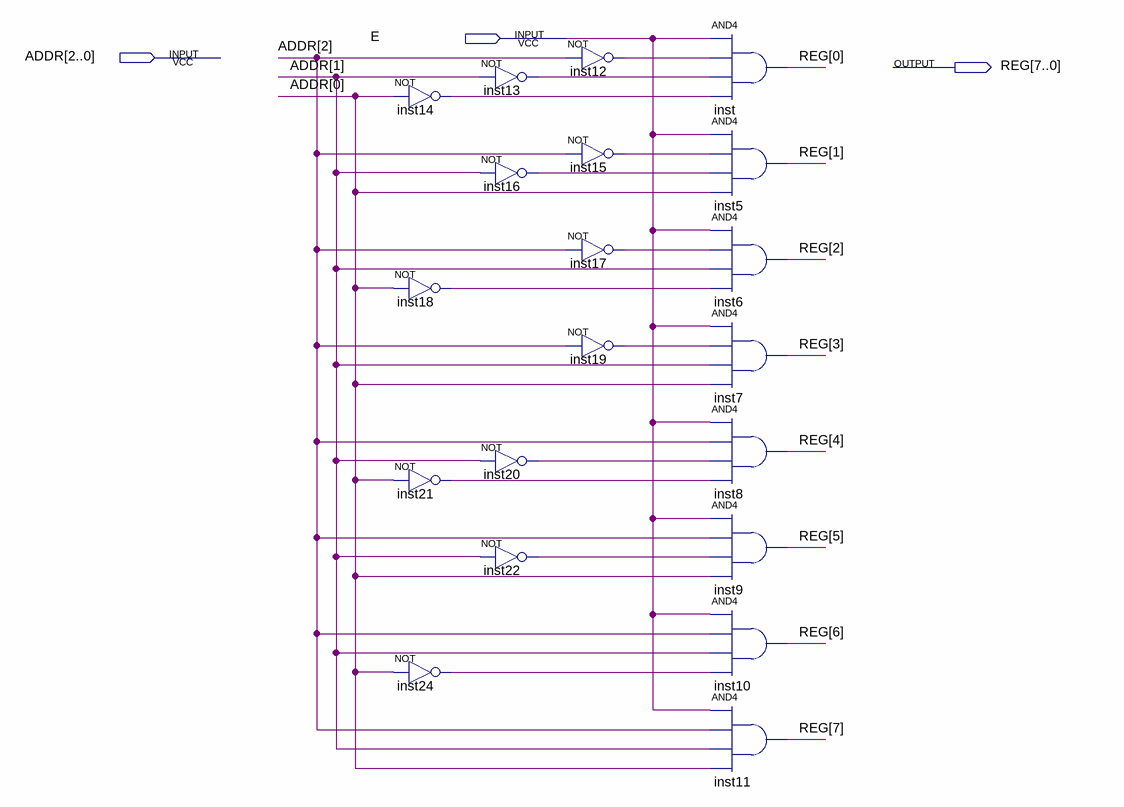
[diagram p0: schematic sheet]
// Quartus schematic Decoder3to8.bdf as structural Verilog: 20 symbols, 3 pins
module Decoder3to8 (
  input  E,
  input  [2:0] ADDR,
  output [7:0] REG
);

  wire inst12_out, inst13_out, inst14_out, inst15_out, inst16_out, inst17_out, inst18_out, inst19_out,
       inst20_out, inst21_out, inst22_out, inst24_out;

  not inst14 (inst14_out, ADDR[0]);
  not inst18 (inst18_out, ADDR[0]);
  not inst21 (inst21_out, ADDR[0]);
  not inst24 (inst24_out, ADDR[0]);
  not inst13 (inst13_out, ADDR[1]);
  not inst16 (inst16_out, ADDR[1]);
  not inst20 (inst20_out, ADDR[1]);
  not inst22 (inst22_out, ADDR[1]);
  not inst12 (inst12_out, ADDR[2]);
  not inst15 (inst15_out, ADDR[2]);
  not inst17 (inst17_out, ADDR[2]);
  not inst19 (inst19_out, ADDR[2]);
  and inst (REG[0], E, inst12_out, inst13_out, inst14_out);
  and inst5 (REG[1], E, inst15_out, inst16_out, ADDR[0]);
  and inst6 (REG[2], E, inst17_out, ADDR[1], inst18_out);
  and inst7 (REG[3], E, inst19_out, ADDR[1], ADDR[0]);
  and inst8 (REG[4], E, ADDR[2], inst20_out, inst21_out);
  and inst9 (REG[5], E, ADDR[2], inst22_out, ADDR[0]);
  and inst10 (REG[6], E, ADDR[2], ADDR[1], inst24_out);
  and inst11 (REG[7], E, ADDR[2], ADDR[1], ADDR[0]);
endmodule
